# Altium schematic sheet Sheet1.SchDoc
size A4
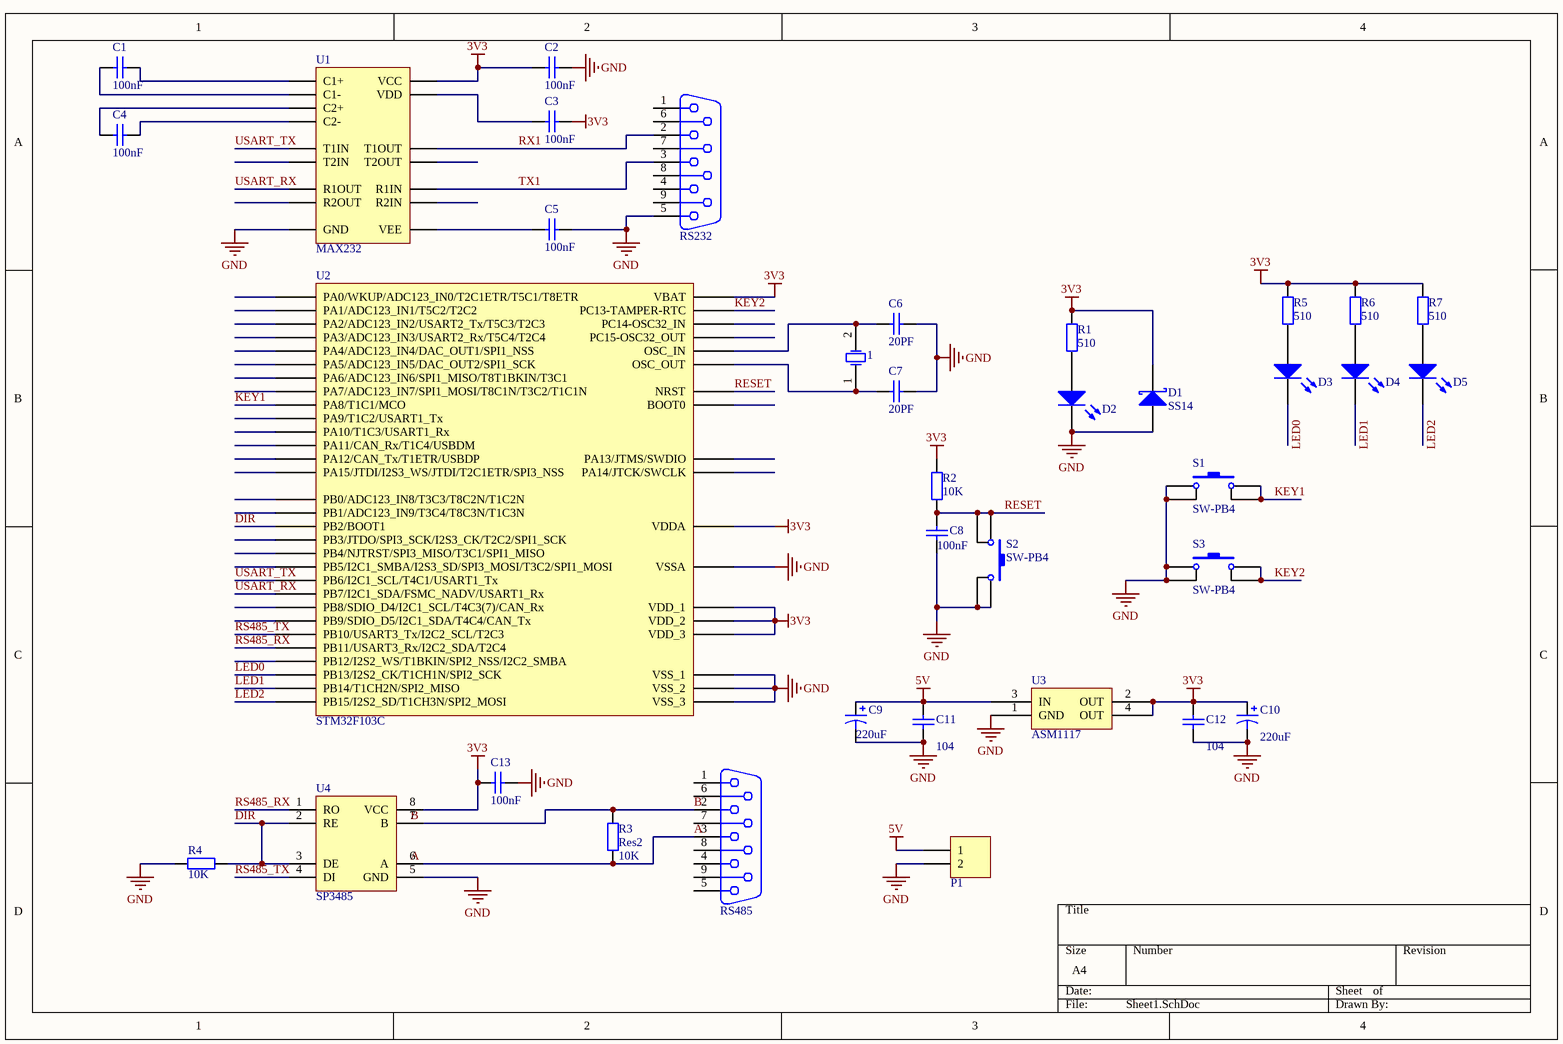
[diagram p0: Sheet1.SchDoc]

## Parts
1  XTAL  [XTAL]  (value not drawn)
C1  value 100nF  [0805]  (hidden comment: Cap)
C2  value 100nF  [0805]  (hidden comment: Cap)
C3  value 100nF  [0805]  (hidden comment: Cap)
C4  value 100nF  [0805]  (hidden comment: Cap)
C5  value 100nF  [0805]  (hidden comment: Cap)
C6  20PF  [0805]
C7  20PF  [0805]
C8  value 100nF  [0805]  (hidden comment: Cap)
C9  value 220uF  [CAP-3528]  (hidden comment: Cap Pol1)
C10  value 220uF  [CAP-3528]  (hidden comment: Cap Pol1)
C11  value 104  [0805]  (hidden comment: Cap)
C12  value 104  [0805]  (hidden comment: Cap)
C13  value 100nF  [0805]  (hidden comment: Cap)
D1  Type: SS14  [DIODE-SMA]  (hidden comment: D-Schottky)
D2  LED0  [LED_0805]  (value not drawn)
D3  LED0  [LED_0805]  (value not drawn)
D4  LED0  [LED_0805]  (value not drawn)
D5  LED0  [LED_0805]  (value not drawn)
P1  Header 2  [HDR2X1_D1]  (value not drawn)
R1  510  [0805]
R2  10K  [0805]
R3  Res2  value 10K  [0805]
R4  10K  [0805]
R5  510  [0805]
R6  510  [0805]
R7  510  [0805]
RS232  D Connector 9  [HDR3X1_D1]  (value not drawn)
RS485  D Connector 9  [HDR2X1_D1]  (value not drawn)
S1  SW-PB4  [SW_PB4_A1]
S2  SW-PB4  [SW_PB4_A1]
S3  SW-PB4  [SW_PB4_A1]
U1  MAX232  [NSO16_M]
U2  STM32F103C  [LQFP-48_M]
U3  ASM1117  [SOT-223]
U4  SP3485  [NSO8_N]

## Nets
3V3: C2.1 C3.2 C10.1 C12.2 C13.2 D1.2(K) R1.2 R2.2 R5.2 R6.2 R7.2 U1.16(VCC) U2.1(VBAT) U2.9(VDDA) U2.24(VDD_1) U2.36(VDD_2) U2.48(VDD_3) U3.2(OUT) U3.4(OUT) U4.8(VCC)
5V: C9.1 C11.2 P1.1 U3.3(IN)
GND: C2.2 C5.2 C6.2 C7.2 C8.2 C9.2 C10.2 C11.1 C12.1 C13.1 D1.1(A) D2.2(K) P1.2 R4.1 RS232.5 S1.1 S1.4 S2.2 S2.3 S3.1 S3.4 U1.15(GND) U2.8(VSSA) U2.23(VSS_1) U2.35(VSS_2) U2.47(VSS_3) U3.1(GND) U4.5(GND)
A: R3.2 RS485.3 U4.6(A)
B: R3.1 RS485.2 U4.7(B)
DIR: R4.2 U2.20(PB2/BOOT1) U4.2(RE) U4.3(DE)
KEY1: S1.2 S1.3 U2.29(PA8/T1C1/MCO)
KEY2: S3.2 S3.3 U2.2(PC13-TAMPER-RTC)
LED0: D3.2(K) U2.26(PB13/I2S2_CK/T1CH1N/SPI2_SCK)
LED1: D4.2(K) U2.27(PB14/T1CH2N/SPI2_MISO)
LED2: D5.2(K) U2.28(PB15/I2S2_SD/T1CH3N/SPI2_MOSI)
RESET: C8.1 R2.1 S2.1 S2.4 U2.7(NRST)
RS485_RX: U2.22(PB11/USART3_Rx/I2C2_SDA/T2C4) U4.1(RO)
RS485_TX: U2.21(PB10/USART3_Tx/I2C2_SCL/T2C3) U4.4(DI)
RX1: RS232.2 U1.14(T1OUT)
TX1: RS232.3 U1.13(R1IN)
USART_RX: U1.12(R1OUT) U2.43(PB7/I2C1_SDA/FSMC_NADV/USART1_Rx)
USART_TX: U1.11(T1IN) U2.42(PB6/I2C1_SCL/T4C1/USART1_Tx)
Net1_1: 1.1(OSC1) C7.1 U2.6(OSC_OUT)
Net1_2: 1.2(OSC2) C6.1 U2.5(OSC_IN)
NetC1_1: C1.1 U1.1(C1+)
NetC1_2: C1.2 U1.3(C1-)
NetC3_1: C3.1 U1.2(VDD)
NetC4_1: C4.1 U1.5(C2-)
NetC4_2: C4.2 U1.4(C2+)
NetC5_1: C5.1 U1.6(VEE)
NetD2_1: D2.1(A) R1.1
NetD3_1: D3.1(A) R5.1
NetD4_1: D4.1(A) R6.1
NetD5_1: D5.1(A) R7.1

Not connected (* = marked no-connect by the designer): RS232 1 4 6 7 8 9 10(MH1) 11(MH2); RS485 1 4 5 6 7 8 9 10(MH1) 11(MH2); U1 7(T2OUT) 8(R2IN) 9(R2OUT) 10(T2IN); U2 3(PC14-OSC32_IN) 4(PC15-OSC32_OUT) 10(PA0/WKUP/ADC123_IN0/T2C1ETR/T5C1/T8ETR) 11(PA1/ADC123_IN1/T5C2/T2C2) 12(PA2/ADC123_IN2/USART2_Tx/T5C3/T2C3) 13(PA3/ADC123_IN3/USART2_Rx/T5C4/T2C4) 14(PA4/ADC123_IN4/DAC_OUT1/SPI1_NSS) 15(PA5/ADC123_IN5/DAC_OUT2/SPI1_SCK) 16(PA6/ADC123_IN6/SPI1_MISO/T8T1BKIN/T3C1) 17(PA7/ADC123_IN7/SPI1_MOSI/T8C1N/T3C2/T1C1N) 18(PB0/ADC123_IN8/T3C3/T8C2N/T1C2N) 19(PB1/ADC123_IN9/T3C4/T8C3N/T1C3N) 25(PB12/I2S2_WS/T1BKIN/SPI2_NSS/I2C2_SMBA) 30(PA9/T1C2/USART1_Tx) 31(PA10/T1C3/USART1_Rx) 32(PA11/CAN_Rx/T1C4/USBDM) 33(PA12/CAN_Tx/T1ETR/USBDP) 34(PA13/JTMS/SWDIO) 37(PA14/JTCK/SWCLK) 38(PA15/JTDI/I2S3_WS/JTDI/T2C1ETR/SPI3_NSS) 39(PB3/JTDO/SPI3_SCK/I2S3_CK/T2C2/SPI1_SCK) 40(PB4/NJTRST/SPI3_MISO/T3C1/SPI1_MISO) 41(PB5/I2C1_SMBA/I2S3_SD/SPI3_MOSI/T3C2/SPI1_MOSI) 44(BOOT0) 45(PB8/SDIO_D4/I2C1_SCL/T4C3(7)/CAN_Rx) 46(PB9/SDIO_D5/I2C1_SDA/T4C4/CAN_Tx)

## Notes on the sheet
- Labels drawn without touching a wire or pin: A, B

## Library data of the parts
1 = XTAL: Crystal Oscillator; Published: 8-Jun-2000; LatestRevisionDate: 17-Jul-2002; LatestRevisionNote: Re-released for DXP Platform.; PackageReference: R38; Publisher: Altium Limited; PackageDescription: Crystal, Thru-Hole; 2 Leads; Body 3.1 x 8.2 mm (Dia.xH)
C1-C8 C11-C13 = Cap: Capacitor; Published: 8-Jun-2000; LatestRevisionDate: 17-Jul-2002; LatestRevisionNote: Re-released for DXP Platform.; PackageReference: RAD-0.3; Publisher: Altium Limited; PackageDescription: Radial Cap, Thru-Hole; 2 Leads; 0.3 in Pin Spacing
  C6 C7: Value: 20pF
C9 C10 = Cap Pol1: Polarized Capacitor (Radial); Published: 8-Jun-2000; LatestRevisionDate: 17-Jul-2002; LatestRevisionNote: Re-released for DXP Platform.; PackageReference: RB7.6-15; Publisher: Altium Limited; PackageDescription: Polarized Capacitor (Radial); 2 Leads
D1 = D-Schottky: 肖特基二极管; Published: 8-Jun-2000; LatestRevisionDate: 17-Jul-2002; LatestRevisionNote: Re-released for DXP Platform.; PackageReference: SMB; Publisher: Altium Limited; Code_JEDEC: DO-214-AA
D2-D5 = LED0: 发光二极管; Published: 8-Jun-2000; LatestRevisionDate: 08-Jul-2005; LatestRevisionNote: Mech Layer 1 removed.; PackageReference: LED-0; Publisher: Altium Limited
P1 = Header 2: 接插件; LatestRevisionDate: 17-Jul-2002; LatestRevisionNote: Re-released for DXP Platform.; Publisher: Altium Limited
R1 R5-R7 = Res2: Resistor; Value: 10K; Published: 8-Jun-2000; LatestRevisionDate: 17-Jul-2002; LatestRevisionNote: Re-released for DXP Platform.; PackageReference: AXIAL-0.4; Publisher: Altium Limited; PackageDescription: Axial Device, Thru-Hole; 2 Leads; 0.4 in Pin Spacing
R2-R4 = Res2: Resistor; Published: 8-Jun-2000; LatestRevisionDate: 17-Jul-2002; LatestRevisionNote: Re-released for DXP Platform.; PackageReference: AXIAL-0.4; Publisher: Altium Limited; PackageDescription: Axial Device, Thru-Hole; 2 Leads; 0.4 in Pin Spacing
  R2 R4: Value: 10K
RS232 = D Connector 9: 串口; pin to pad: 1>none 2>1 3>2 4>none 5>3 6>none 7>none 8>none 9>none 10>none 11>none; PackageDocument: O; Positions: 9; Gender: Receptacle; Published: 15-Jun-2001; LatestRevisionDate: 17-Jul-2002; LatestRevisionNote: Re-released for DXP Platform.; DatasheetDocument: 1-Sep-1999; PackageReference: 788750; Publisher: Altium Limited; Orientation: Right Angle
RS485 = D Connector 9: 串口; pin to pad: 1>none 2>1 3>2 4>none 5>none 6>none 7>none 8>none 9>none 10>none 11>none; PackageDocument: O; Positions: 9; Gender: Receptacle; Published: 15-Jun-2001; LatestRevisionDate: 17-Jul-2002; LatestRevisionNote: Re-released for DXP Platform.; DatasheetDocument: 1-Sep-1999; PackageReference: 788750; Publisher: Altium Limited; Orientation: Right Angle
S1-S3 = SW-PB4: 微动开关; Published: 24-Mar-1999; LatestRevisionDate: 17-Jul-2002; LatestRevisionNote: Re-released for DXP Platform.; PackageReference: SPST-2; Publisher: Altium Limited
U1 = MAX232: +5V Powered, Multi-Channel RS-232 Driver/Receiver; Published: 16-Jan-2001; LatestRevisionDate: 13-Apr-2006; LatestRevisionNote: IPC-7351 Footprint Added.; PackageReference: NSO16; Publisher: Altium Limited; PackageDescription: 16-Pin Small Outline Integrated Circuit 1.27 mm Pitch; Code_JEDEC: MS-012-AC; Code_IPC: SOIC127P600-16; ComponentLink1Description: Manufacturer Link; ComponentLink1URL: http://www.maxim-ic.com/; ComponentLink2Description: Datasheet; ComponentLink2URL: http://pdfserv.maxim-ic.com/en/ds/MAX220-MAX249.pdf
U2 = STM32F103C: STM32单片机48引脚
U3 = ASM1117: 3.3V稳压芯片
U4 = SP3485: 485总线芯片